# Altium schematic sheet ServoBoard.schdoc: Контроллер двигателя
size 420 x 297 mm; ApprovedBy: Алексеев; CheckedBy: Алексеев; DrawnBy: Подлесный; DocumentNumber: ХХХХ.654455.001 Э3; SheetTotal: 1; Title1str: (при необходимости вторая строка); DocumentType: Схема электрическая принципиальная; Format: A3; ImagePath: ХХХХ.654455.001
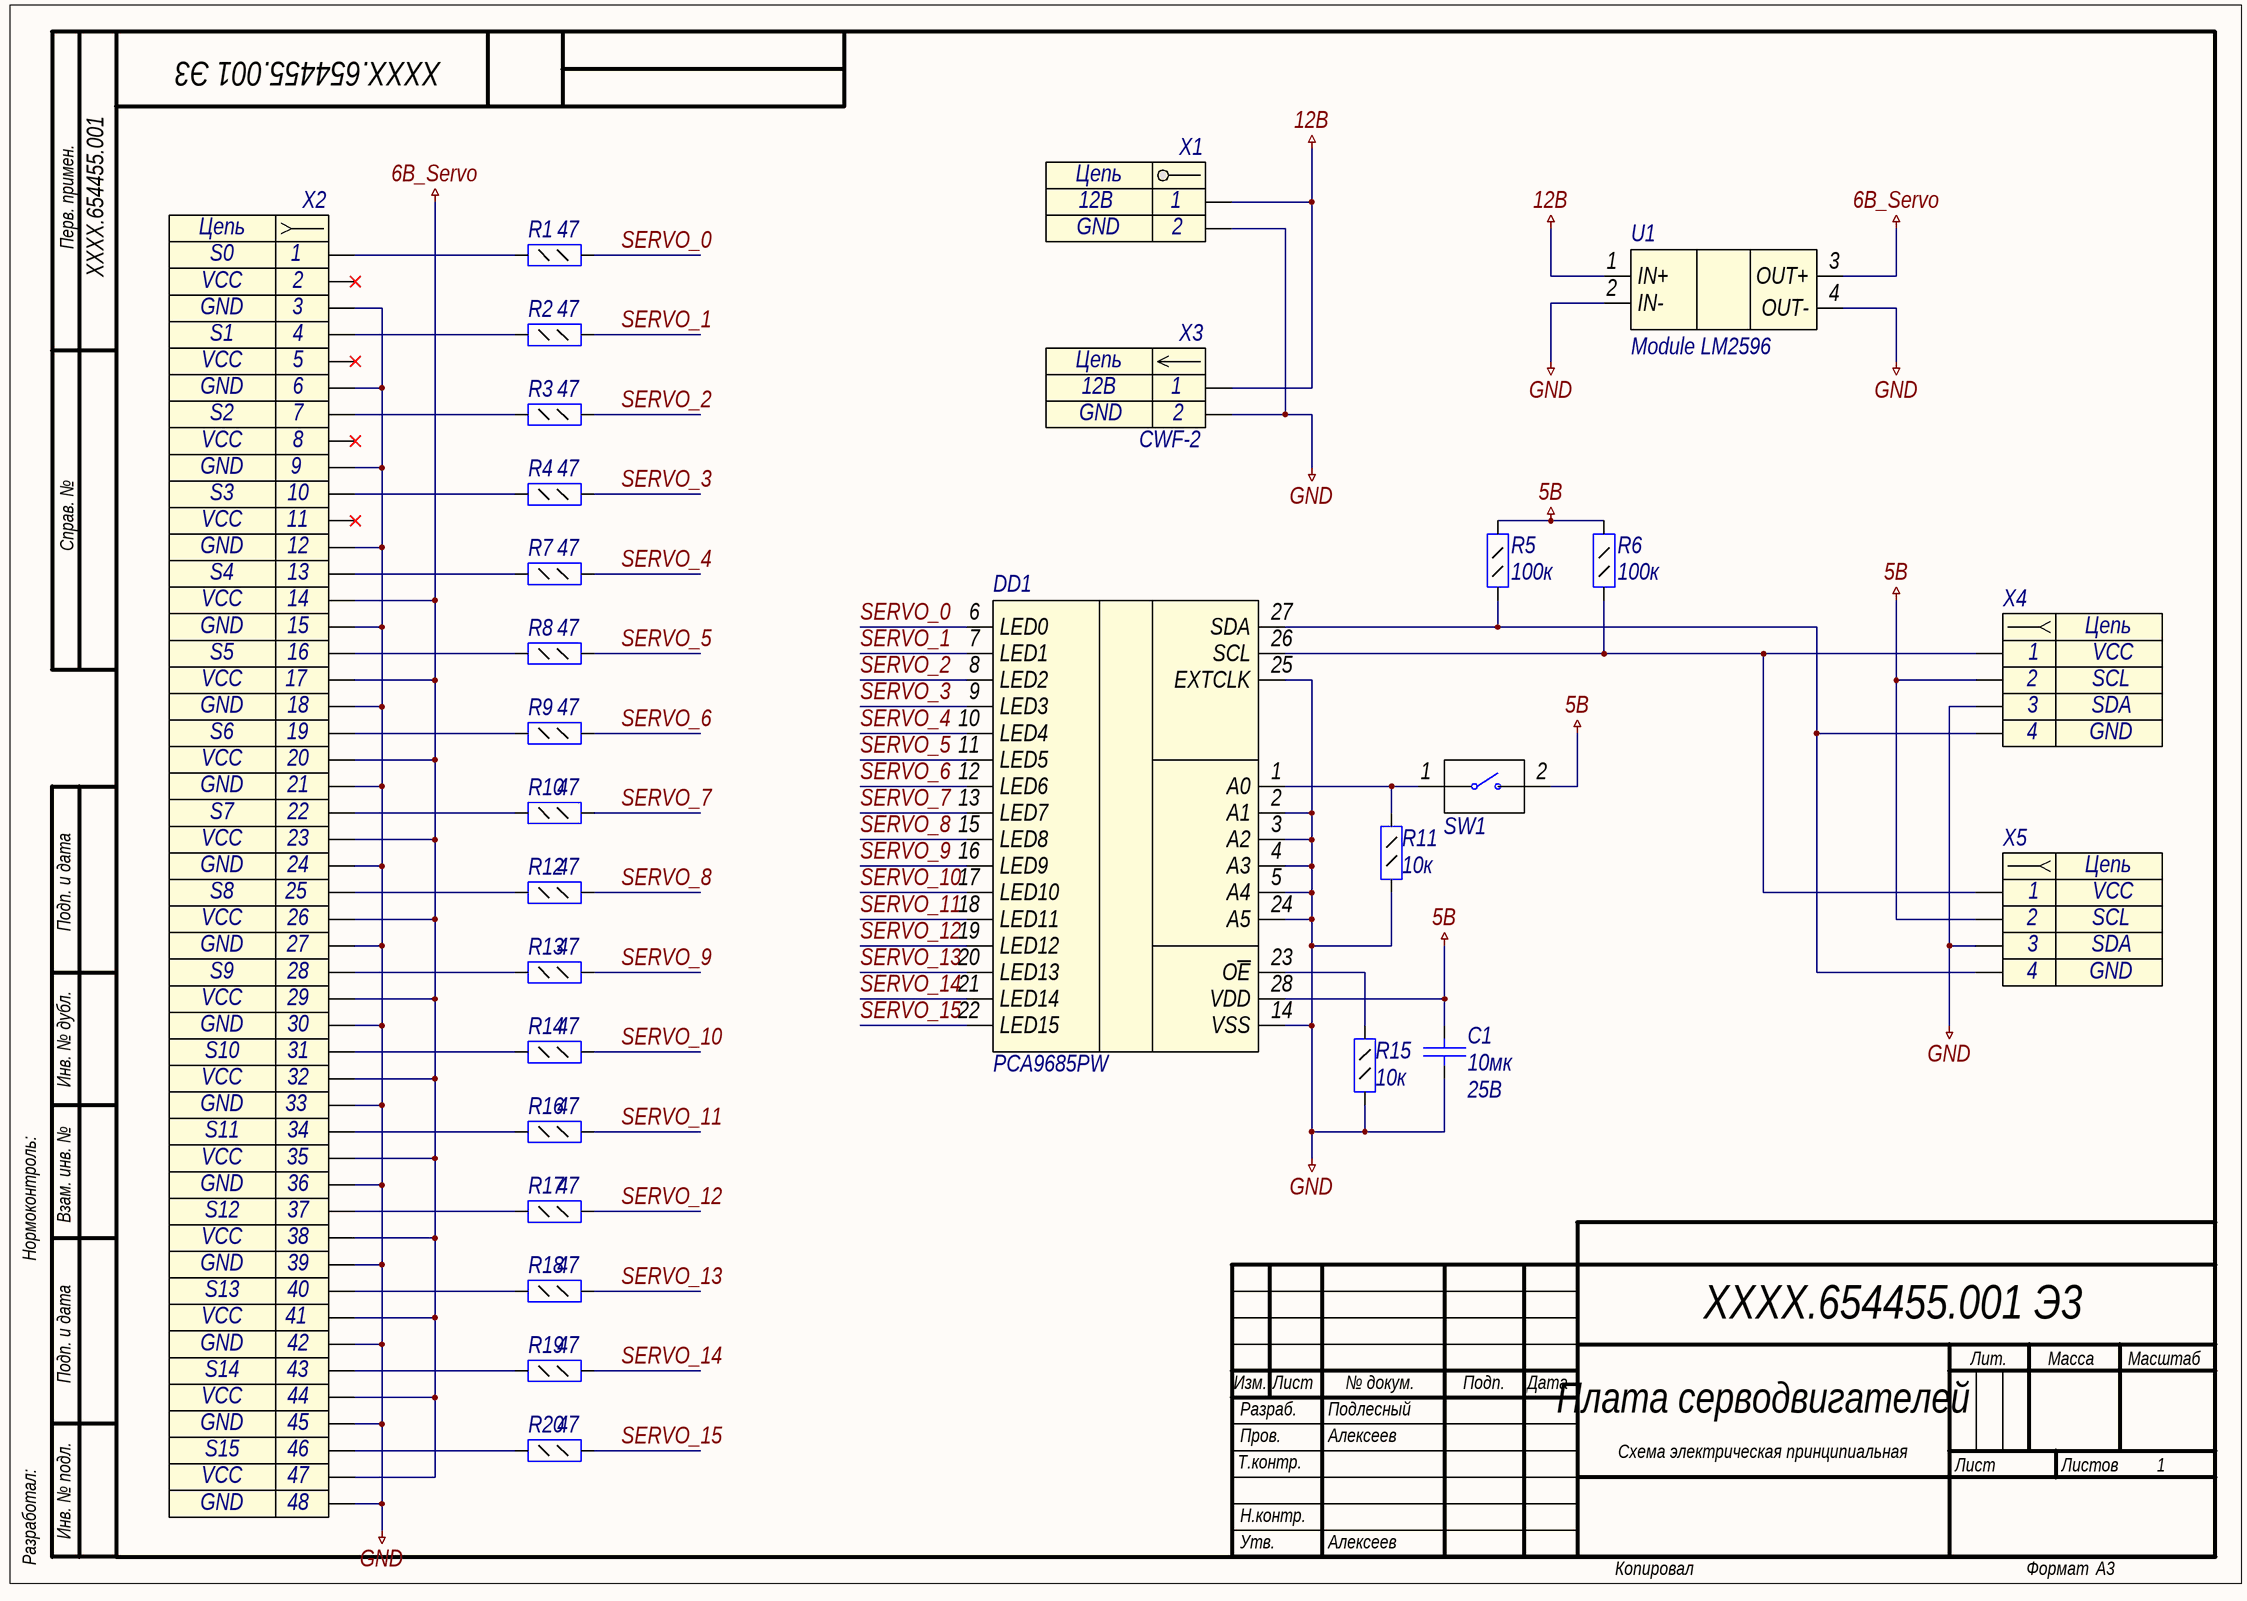
[diagram p0: ServoBoard.schdoc]

## Parts
C1  value 10мк  Voltage: 25В  [C1206]  (hidden comment: Capacitor)
DD1  PCA9685PW  [TSSOP28]
R1  value 47  [R0805]  (hidden comment: Resistor_0,125Вт)
R2  value 47  [R0805]  (hidden comment: Resistor_0,125Вт)
R3  value 47  [R0805]  (hidden comment: Resistor_0,125Вт)
R4  value 47  [R0805]  (hidden comment: Resistor_0,125Вт)
R5  value 100к  [R0805]  (hidden comment: Resistor_0,125Вт)
R6  value 100к  [R0805]  (hidden comment: Resistor_0,125Вт)
R7  value 47  [R0805]  (hidden comment: Resistor_0,125Вт)
R8  value 47  [R0805]  (hidden comment: Resistor_0,125Вт)
R9  value 47  [R0805]  (hidden comment: Resistor_0,125Вт)
R10  value 47  [R0805]  (hidden comment: Resistor_0,125Вт)
R11  value 10к  [R0805]  (hidden comment: Resistor_0,125Вт)
R12  value 47  [R0805]  (hidden comment: Resistor_0,125Вт)
R13  value 47  [R0805]  (hidden comment: Resistor_0,125Вт)
R14  value 47  [R0805]  (hidden comment: Resistor_0,125Вт)
R15  value 10к  [R0805]  (hidden comment: Resistor_0,125Вт)
R16  value 47  [R0805]  (hidden comment: Resistor_0,125Вт)
R17  value 47  [R0805]  (hidden comment: Resistor_0,125Вт)
R18  value 47  [R0805]  (hidden comment: Resistor_0,125Вт)
R19  value 47  [R0805]  (hidden comment: Resistor_0,125Вт)
R20  value 47  [R0805]  (hidden comment: Resistor_0,125Вт)
SW1  DS1040-01  [1PAD_ADR]  (value not drawn)
U1  Module LM2596  [module LM2596]
X1  Header_2_trm  [TERMINAL-2WAY-3.5MM]  (value not drawn)
X2  Header_48_plg  [PLS-48]  (value not drawn)
X3  (no value)  [CWF-2]
X4  Header_4_sct  [RJ11_4P4C_V]  (value not drawn)
X5  Header_4_sct  [RJ11_4P4C_V]  (value not drawn)

## Nets
5B: C1.2 DD1.28(VDD) R5.2 R6.2 SW1.2 X4.2 X5.2
6B_Servo: U1.3(OUT+) X2.14 X2.17 X2.20 X2.23 X2.26 X2.29 X2.32 X2.35 X2.38 X2.41 X2.44 X2.47
12B: U1.1(IN+) X1.1 X3.1
GND: C1.1 DD1.2(A1) DD1.3(A2) DD1.4(A3) DD1.5(A4) DD1.14(VSS) DD1.24(A5) DD1.25(EXTCLK) R11.2 R15.2 U1.2(IN-) U1.4(OUT-) X1.2 X2.3 X2.6 X2.9 X2.12 X2.15 X2.18 X2.21 X2.24 X2.27 X2.30 X2.33 X2.36 X2.39 X2.42 X2.45 X2.48 X3.2 X4.3 X5.3
SERVO_0: DD1.6(LED0) R1.2
SERVO_1: DD1.7(LED1) R2.2
SERVO_2: DD1.8(LED2) R3.2
SERVO_3: DD1.9(LED3) R4.2
SERVO_4: DD1.10(LED4) R7.2
SERVO_5: DD1.11(LED5) R8.2
SERVO_6: DD1.12(LED6) R9.2
SERVO_7: DD1.13(LED7) R10.2
SERVO_8: DD1.15(LED8) R12.2
SERVO_9: DD1.16(LED9) R13.2
SERVO_10: DD1.17(LED10) R14.2
SERVO_11: DD1.18(LED11) R16.2
SERVO_12: DD1.19(LED12) R17.2
SERVO_13: DD1.20(LED13) R18.2
SERVO_14: DD1.21(LED14) R19.2
SERVO_15: DD1.22(LED15) R20.2
NetDD1_1: DD1.1(A0) R11.1 SW1.1
NetDD1_23: DD1.23(O~{E}) R15.1
NetDD1_26: DD1.26(SCL) R6.1 X4.1 X5.1
NetDD1_27: DD1.27(SDA) R5.1 X4.4 X5.4
NetR1_1: R1.1 X2.1
NetR2_1: R2.1 X2.4
NetR3_1: R3.1 X2.7
NetR4_1: R4.1 X2.10
NetR7_1: R7.1 X2.13
NetR8_1: R8.1 X2.16
NetR9_1: R9.1 X2.19
NetR10_1: R10.1 X2.22
NetR12_1: R12.1 X2.25
NetR13_1: R13.1 X2.28
NetR14_1: R14.1 X2.31
NetR16_1: R16.1 X2.34
NetR17_1: R17.1 X2.37
NetR18_1: R18.1 X2.40
NetR19_1: R19.1 X2.43
NetR20_1: R20.1 X2.46

Not connected (* = marked no-connect by the designer): X2 2* 5* 8* 11*

## Notes on the sheet
- Перв. примен.
- Справ. №
- Подп. и дата
- Инв. № дубл.
- Нормоконтроль:
- Взам. инв. №
- Изм.
- Лист
- № докум.
- Подп.
- Дата
- Лит.
- Масса
- Масштаб
- Т.контр.
- Пров.
- Разраб.
- Плата серводвигателей
- Листов
- Разработал:
- Инв. № подл.
- Н.контр.
- Утв.
- Копировал
- Формат
- (in symbol connect15) Цепь
- (in symbol connect28) Цепь
- (in symbol connect34) Цепь
- (in symbol connect73) Цепь

## Library data of the parts
C1 = cap186: Конденсатор; Part Name: Ceramic; Manufacture: Murata; Part Number: GRM31CR71E106KA12L*; id: cap186; TKE: X7R
DD1 = driver0: Драйвер светодиода, 16 выходов; Part Name: LED Driver; Part Number: PCA9685PW,112; Operating Supply Voltage: 3,3B; Min Operating Supply Voltage: 2,3B; Max Operating Supply Voltage: 5,5B; Max Supply Current: 10000uA; Maximum Power Dissipation: 400mW; id: driver0
R1-R4 R7-R10 R12-R14 R16-R20 = res41: Резистор; Manufacture: Yageo; Part Number: RC0805FR-0747RL; id: res41; Accuracy: 0,01; Part Name: Resistor; Power: 0,125Вт
R5 R6 = res125: Резистор; Manufacture: Yageo; Part Number: RC0805FR-07100KL; id: res125; Accuracy: 0,01; Part Name: Resistor; Power: 0,125Вт
R11 R15 = res97: Резистор; id: res97; Accuracy: 1%; Part Name: Resistor; Power: 0,125Вт
SW1 = btn7: DIP переключатель; Part Name: Перемычка адреса; id: btn7
U1 = module0: Low-Dropout Regulator for 5-V to 3.3-V Conversion; id: module0; Part Name: LM2596
X1 = connect34: Разъем - 2 конт. клеммник; Part Name: TERMINAL BLOCK 2 way; Contact_1: 12B; Contact_2: GND; Etch: 3.5mm; id: connect34
X2 = connect28: Разъем - 5 конт. вилка; Part Number: DS1021-1*48SF112-B; Manufacture: Ningbo connfly electronic; Contact_1: S0; Contact_2: VCC; Contact_3: GND; Contact_4: S1; Etch: 2,54mm; Contact_7: S2; Contact_10: S3; Contact_13: S4; Contact_16: S5; Contact_19: S6; Contact_22: S7; Contact_25: S8; Contact_28: S9; Contact_31: S10; Contact_34: S11; Contact_37: S12; Contact_40: S13; Contact_43: S14; Contact_46: S15; Part Name: PLS-48; Contact_5: VCC; Contact_6: GND; id: connect28; Contact_8: VCC; Contact_9: GND; Contact_11: VCC; Contact_12: GND; Contact_14: VCC; Contact_15: GND; Contact_17: VCC; Contact_18: GND; Contact_20: VCC; Contact_21: GND; Contact_23: VCC; Contact_24: GND; Contact_26: VCC; Contact_27: GND; Contact_29: VCC; Contact_30: GND; Contact_32: VCC; Contact_33: GND; Contact_35: VCC; Contact_36: GND; Contact_38: VCC; Contact_39: GND; Contact_41: VCC; Contact_42: GND; Contact_44: VCC; Contact_45: GND; Contact_47: VCC; Contact_48: GND
X3 = connect15: Разъем - 2 конт. вилка; Part Number: DS1069-2MVW6X; Manufacture: Ningbo connfly electronic; Contact_1: 12B; Contact_2: GND; Etch: 2,5mm; Part Name: CWF-2; id: connect15
X4 X5 = connect73: Разъем - 4 конт. розетка; Part Name: Jack 4p4c (RJ11, RJ14) Vertical; Contact_1: VCC; Contact_2: SCL; Contact_3: SDA; Contact_4: GND; id: connect73